# Altium schematic sheet Sheet1.SchDoc
size A; SheetNumber: 1; SheetTotal: 1
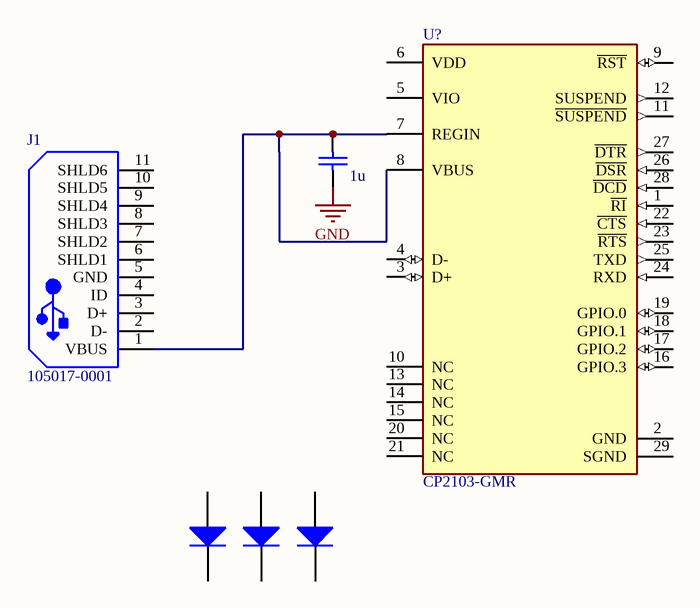
[diagram p0: Sheet1.SchDoc]

## Parts
C_Generic_1  value 1u  (hidden comment: Capacitor)
D_Generic_1  Diode  (value not drawn)
D_Generic_2  Diode  (value not drawn)
D_Generic_3  Diode  (value not drawn)
J1  105017-0001  [USB-MICRO-B_V]
U?  CP2103-GMR  [FP-CP2103-GMR-MFG]

## Nets
GND: C_Generic_1.2
NetC_Generic_1_1: C_Generic_1.1 J1.1(VBUS) U?.7(REGIN) U?.8(VBUS)

Not connected (* = marked no-connect by the designer): D_Generic_1 1(A) 2(K); D_Generic_2 1(A) 2(K); D_Generic_3 1(A) 2(K); J1 2(D-) 3(D+) 4(ID) 5(GND) 6(SHLD1) 7(SHLD2) 8(SHLD3) 9(SHLD4) 10(SHLD5) 11(SHLD6); U? 1(~{RI}) 2(GND) 3(D+) 4(D-) 5(VIO) 6(VDD) 9(~{RST}) 10(NC) 11(~{SUSPEND}) 12(SUSPEND) 13(NC) 14(NC) 15(NC) 16(GPIO.3) 17(GPIO.2) 18(GPIO.1) 19(GPIO.0) 20(NC) 21(NC) 22(~{CTS}) 23(~{RTS}) 24(RXD) 25(TXD) 26(~{DSR}) 27(~{DTR}) 28(~{DCD}) 29(SGND)

## Library data of the parts
C_Generic_1 = Capacitor: SimulationGenericComponent: True
D_Generic_1-D_Generic_3 = Diode: AF: 1; BV: 0; BV_MAX: 1e99; EG: 1.11; FC: 0.5; IBV: 0.001; ISR: 1e-14; MJSW: 0.33; NTUN: 30; TNOM: 27; XTI: 3; SimulationGenericComponent: True; CJO: 0; CJP: 0; CTA: 0; CTP: 0; FCS: 0.5; FV_MAX: 1e99; IKF: 0; IKR: 0; JSW: 0; JTUN: 0; JTUNSW: 0; KEG: 1; KF: 0; LEVEL: 1; N: 1; NBV: 1; NR: 1; NS: 1; PHP: 1; RS: 0; TCV: 0; TLEV: 0; TLEVC: 0; TM1: 0; TM2: 0; TPB: 0; TPHP: 0; TRS: 0; TRS2: 0; TT: 0; TTT1: 0; TTT2: 0; VJ: 1; XTITUN: 3; IS: 1e-14
J1 = CMP-2000-05827-1: Micro-USB B Receptacle, Right Angle, Bottom Mount, Surface Mount, with Solder Tabs, -30 to 85 degC, 5-Pin USB, RoHS, Tape and Reel; Manufacturer: Molex; Featured Product: Micro-USBConnectorsUSBConnectors; Other Names: WM1399DKR; Package Version: Rev. F, 12/2012; Number of Contacts: 5; Connector Type: USB-microB; Catalog Drawings: 1050170001; 3D Model: 105017-0001.stp; Mating Products: WM17145-ND-CABLEMICROUSBBTOSTDA1.0MWM17147-ND-CABLEMICROUSBBTOSTDA2.0MWM17146-ND-CABLEMICROUSBBTOSTDA1.5M; PCN Assembly/Origin: ResinSupplier21/Oct/2015; Voltage - Max: 30V; Online Catalog: Molex-MicroUSB; Manufacturer URL: http://www.molex.com/; Package Description: 5-Leads USB, Micro B, Body 7.5 x 5 mm, Pitch 0.65 mm; Datasheet URL: http://www.molex.com/elqNow/elqRedir.htm?ref=http://www.molex.com/webdocs/datasheets/pdf/en-us/1050170001_IO_CONNECTORS.pdf; Ingress Protection: -; Datasheet Version: 03/2016; Mounting Type: BoardCutout,SurfaceMount,RightAngle; Circuits: 5; Standard Package: 1; Package Reference: MICRO-B; Package URL: http://www.molex.com/pdm_docs/sd/1050170001_sd.pdf; Category: Connectors,Interconnects; Series: -; RoHS Information: 1050170001CertofCompliance; Features: Shielded,SolderRetention; Family: USB,DVI,HDMIConnectors; Specifications: -; Gender: Receptacle; Packaging: Digi-Reel®; Mounting Technology: SurfaceMount
U? = CMP-08107-000005-1: IC CTRLR BRIDGE USB-UART 28MLP; Manufacturer: Silicon Labs; Nominal Supply Current: 20mA; Interface: UART,USB,RS-232,RS-485; Max Supply Voltage: 3.6V; Min Supply Voltage: 1.8V; Standoff Height: 0.03mm; Description: Full Speed USB to UART Bridge USB 2.0 3.3V T/R Automotive 28-Pin QFN EP; Function: Bridge, USB to UART; ComponentLink2Description: Datasheet; Automotive: No; Device Class L1: Integrated Circuits (ICs); Ambient Temperature Range Low: -55°C; Digikey Description: IC CTRLR BRIDGE USB-UART 28MLP; Temperature Range Low: -40°C; Category: IC; Ambient Temperature Range High: +125°C; Ipc Land Pattern Name: QFN50P500X500X90-28; Device Class L2: Interface ICs; Temperature Range High: +85°C; Mouser Description: I/O Controller Interface IC USB-TO-UART BRIDGE; Octopart: https://octopart.com/cp2103-gmr-silicon+labs-519938; RoHS: TRUE; ComponentLink2URL: https://www.silabs.com/documents/public/data-sheets/CP2103.pdf; Lead Free: Yes; Height: 1mm; Package: 0; Device Class L3: Controllers; Manufacturer Part Number: CP2103-GMR; Temperature: -40°C to +85°C